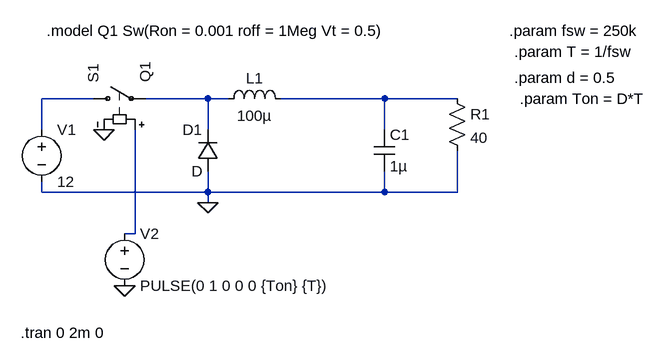
[diagram p0: schematic buck_converter_ideal.asc]
buck_converter_ideal.asc, the LTspice schematic file:
Version 4.1
SHEET 1 880 680
WIRE -16 64 -96 64
WIRE 160 64 64 64
WIRE 192 64 160 64
WIRE 432 64 272 64
WIRE 544 64 432 64
WIRE -96 112 -96 64
WIRE 160 112 160 64
WIRE 432 112 432 64
WIRE -96 208 -96 192
WIRE 160 208 160 176
WIRE 160 208 -96 208
WIRE 432 208 432 176
WIRE 432 208 160 208
WIRE 544 208 544 144
WIRE 544 208 432 208
WIRE 160 224 160 208
WIRE 48 272 48 112
WIRE 48 272 32 272
FLAG 160 224 0
FLAG 32 352 0
FLAG 0 112 0
SYMBOL voltage -96 96 R0
WINDOW 123 0 0 Left 0
WINDOW 39 0 0 Left 0
SYMATTR InstName V1
SYMATTR Value 12
SYMBOL ind 176 80 R270
WINDOW 0 32 56 VTop 2
WINDOW 3 5 56 VBottom 2
SYMATTR InstName L1
SYMATTR Value 100µ
SYMBOL cap 416 112 R0
SYMATTR InstName C1
SYMATTR Value 1µ
SYMBOL diode 176 176 R180
WINDOW 0 24 64 Left 2
WINDOW 3 24 0 Left 2
SYMATTR InstName D1
SYMBOL sw -32 64 R270
SYMATTR InstName S1
SYMATTR Value Q1
SYMBOL res 528 48 R0
SYMATTR InstName R1
SYMATTR Value 40
SYMBOL voltage 32 256 R0
WINDOW 123 0 0 Left 0
WINDOW 39 0 0 Left 0
SYMATTR InstName V2
SYMATTR Value PULSE(0 1 0 0 0 {Ton} {T})
TEXT -88 -40 Left 2 !.model Q1 Sw(Ron = 0.001 roff = 1Meg Vt = 0.5)
TEXT 624 -40 Left 2 !.param fsw = 250k
TEXT 632 -8 Left 2 !.param T = 1/fsw
TEXT 632 32 Left 2 !.param d = 0.5
TEXT 640 64 Left 2 !.param Ton = D*T
TEXT -128 424 Left 2 !.tran 0 2m 0

The netlist it stands for:
* buck_converter_ideal.asc
V1 N001 0 12
L1 N002 N003 100µ
C1 N003 0 1µ
D1 0 N002 D
S1 N001 N002 N004 0 Q1
R1 N003 0 40
V2 N004 0 PULSE(0 1 0 0 0 {Ton} {T})
.model D D
.lib standard.dio
.model Q1 Sw(Ron = 0.001 roff = 1Meg Vt = 0.5)
.param fsw = 250k
.param T = 1/fsw
.param d = 0.5
.param Ton = D*T
.tran 0 2m 0
.backanno
.end